# Altium schematic sheet Sheet3.SchDoc
size A
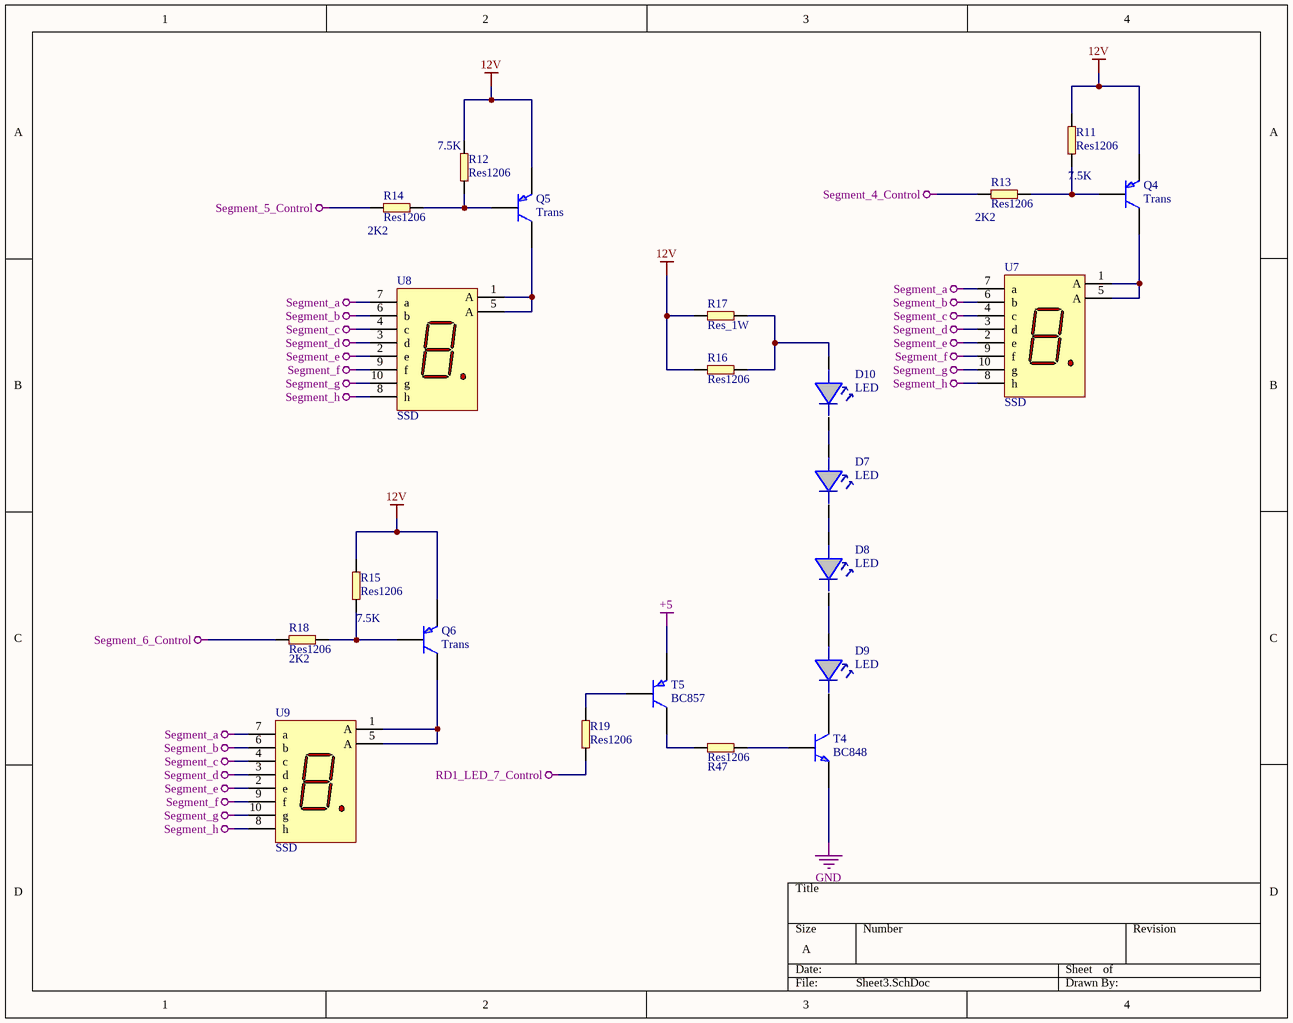
[diagram p0: Sheet3.SchDoc]

## Parts
D7  LED  [LED5MM]
D8  LED  [LED5MM]
D9  LED  [LED5MM]
D10  LED  [LED5MM]
Q4  Trans  [2N6107]
Q5  Trans  [2N6107]
Q6  Trans  [2N6107]
R11  Res1206  value 7.5K  [1206]
R12  Res1206  value 7.5K  [1206]
R13  Res1206  value 2K2  [1206]
R14  Res1206  value 2K2  [1206]
R15  Res1206  value 7.5K  [1206]
R16  Res1206  [1206]
R17  Res_1W  [RES_400_1W]
R18  Res1206  value 2K2  [1206]
R19  Res1206  [1206]
R47  Res1206  [1206]
T4  BC848  [SOT23]
T5  BC857  [SOT23]
U7  SSD  [SP1802_SSD]
U8  SSD  [SP1802_SSD]
U9  SSD  [SP1802_SSD]

## Nets
12V: Q4.3(E) Q5.3(E) Q6.3(E) R11.2(b) R12.1(a) R15.2(b) R16.1(a) R17.2(b)
+5: T5.2(E)
GND: T4.2(E)
RD1_LED_7_Control: R19.2(b)
Segment_4_Control: R13.1(a)
Segment_5_Control: R14.2(b)
Segment_6_Control: R18.1(a)
Segment_a: U7.7(a) U8.7(a) U9.7(a)
Segment_b: U7.6(b) U8.6(b) U9.6(b)
Segment_c: U7.4(c) U8.4(c) U9.4(c)
Segment_d: U7.3(d) U8.3(d) U9.3(d)
Segment_e: U7.2(e) U8.2(e) U9.2(e)
Segment_f: U7.9(f) U8.9(f) U9.9(f)
Segment_g: U7.10(g) U8.10(g) U9.10(g)
Segment_h: U7.8(h) U8.8(h) U9.8(h)
NetD7_1: D7.1(A) D10.2(B)
NetD7_2: D7.2(B) D8.1(A)
NetD8_2: D8.2(B) D9.1(A)
NetD9_2: D9.2(B) T4.3(C)
NetD10_1: D10.1(A) R16.2(b) R17.1(a)
NetQ4_1: Q4.1(B) R11.1(a) R13.2(b)
NetQ4_2: Q4.2(C) U7.1(A) U7.5(A)
NetQ5_1: Q5.1(B) R12.2(b) R14.1(a)
NetQ5_2: Q5.2(C) U8.1(A) U8.5(A)
NetQ6_1: Q6.1(B) R15.1(a) R18.2(b)
NetQ6_2: Q6.2(C) U9.1(A) U9.5(A)
NetR19_1: R19.1(a) T5.1(B)
NetR47_1: R47.1(a) T4.1(B)
NetR47_2: R47.2(b) T5.3(C)

## Library data of the parts
D7-D10 = LED_5MM
Q4-Q6 = 2N6107: pnp transistor
T4 = BC848: TRANSISTOR
U7-U9 = SP1802: SSD 48MM